# Altium schematic sheet Schematic.SchDoc
size A4; SheetNumber: 1; SheetTotal: 1
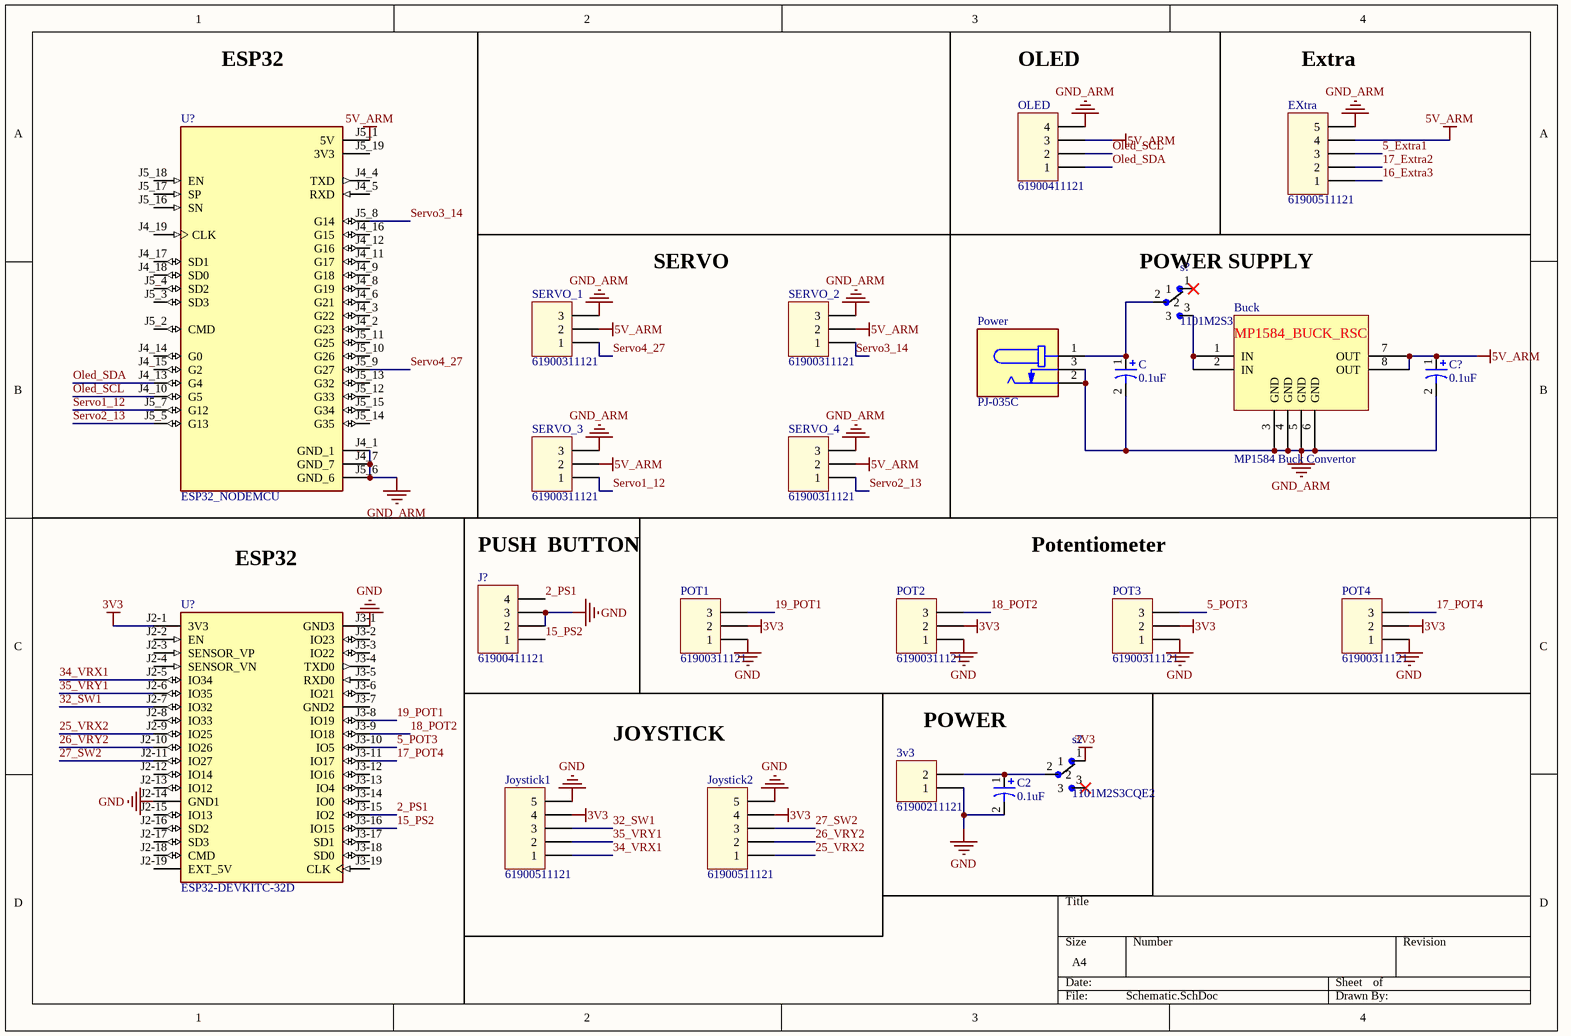
[diagram p0: Schematic.SchDoc]

## Parts
(Parts that share a designator on the sheet are numbered #1, #2 ... from top to bottom, then left to right.)
3v3  61900211121  [61900211121]
Buck  MP1584 Buck Convertor  [MP1584]
C  0.1uF  [WCAP-AT1H 5x11x2x0.5]
C2  0.1uF  [WCAP-AT1H 5x11x2x0.5]
C?  0.1uF  [WCAP-AT1H 5x11x2x0.5]
EXtra  61900511121  [61900511121]
J?  61900411121  [61900411121]
Joystick1  61900511121  [61900511121]
Joystick2  61900511121  [61900511121]
OLED  61900411121  [61900411121]
POT1  61900311121  [61900311121]
POT2  61900311121  [61900311121]
POT3  61900311121  [61900311121]
POT4  61900311121  [61900311121]
Power  PJ-035C  [CUI_PJ-035C]
s2  1101M2S3CQE2  [SW_1101M2S3CQE2]
s?  1101M2S3CQE2  [SW_1101M2S3CQE2]
SERVO_1  61900311121  [61900311121]
SERVO_2  61900311121  [61900311121]
SERVO_3  61900311121  [61900311121]
SERVO_4  61900311121  [61900311121]
U?#1  ESP32_NODEMCU  [MODULE_ESP32_NODEMCU]
U?#2  ESP32-DEVKITC-32D  [MODULE_ESP32-DEVKITC-32D]

## Nets
3V3: Joystick1.4 Joystick2.4 POT1.2 POT2.2 POT3.2 POT4.2 s2.1 U?#2.J2-1(3V3)
5V_ARM: Buck.7(OUT) Buck.8(OUT) C?.1 EXtra.4 OLED.3 SERVO_1.2 SERVO_2.2 SERVO_3.2 SERVO_4.2 U?#1.J5_1(5V)
GND: 3v3.1 C2.2 J?.2 J?.3 Joystick1.5 Joystick2.5 POT1.1 POT2.1 POT3.1 POT4.1 U?#2.J2-14(GND1) U?#2.J3-1(GND3)
GND_ARM: Buck.3(GND) Buck.4(GND) Buck.5(GND) Buck.6(GND) C.2 C?.2 EXtra.5 OLED.4 Power.2 Power.3 SERVO_1.3 SERVO_2.3 SERVO_3.3 SERVO_4.3 U?#1.J4_1(GND_1) U?#1.J4_7(GND_7) U?#1.J5_6(GND_6)
2_PS1: J?.4 U?#2.J3-15(IO2)
5_Extra1: EXtra.3
5_POT3: POT3.3 U?#2.J3-10(IO5)
15_PS2: J?.1 U?#2.J3-16(IO15)
16_Extra3: EXtra.1
17_Extra2: EXtra.2
17_POT4: POT4.3 U?#2.J3-11(IO17)
18_POT2: POT2.3 U?#2.J3-9(IO18)
19_POT1: POT1.3 U?#2.J3-8(IO19)
25_VRX2: Joystick2.1 U?#2.J2-9(IO25)
26_VRY2: Joystick2.2 U?#2.J2-10(IO26)
27_SW2: Joystick2.3 U?#2.J2-11(IO27)
32_SW1: Joystick1.3 U?#2.J2-7(IO32)
34_VRX1: Joystick1.1 U?#2.J2-5(IO34)
35_VRY1: Joystick1.2 U?#2.J2-6(IO35)
Oled_SCL: OLED.2 U?#1.J4_10(G5)
Oled_SDA: OLED.1 U?#1.J4_13(G4)
Servo1_12: SERVO_3.1 U?#1.J5_7(G12)
Servo2_13: SERVO_4.1 U?#1.J5_5(G13)
Servo3_14: SERVO_2.1 U?#1.J5_8(G14)
Servo4_27: SERVO_1.1 U?#1.J5_9(G27)
Net3v3_2: 3v3.2 C2.1 s2.2
NetBuck_1: Buck.1(IN) Buck.2(IN) s?.3
NetC_1: C.1 Power.1 s?.2

Not connected (* = marked no-connect by the designer): s2 3*; s? 1*; U?#1 J4_2(G23) J4_3(G22) J4_4(TXD) J4_5(RXD) J4_6(G21) J4_8(G19) J4_9(G18) J4_11(G17) J4_12(G16) J4_14(G0) J4_15(G2) J4_16(G15) J4_17(SD1) J4_18(SD0) J4_19(CLK) J5_2(CMD) J5_3(SD3) J5_4(SD2) J5_10(G26) J5_11(G25) J5_12(G33) J5_13(G32) J5_14(G35) J5_15(G34) J5_16(SN) J5_17(SP) J5_18(EN) J5_19(3V3); U?#2 J2-2(EN) J2-3(SENSOR_VP) J2-4(SENSOR_VN) J2-8(IO33) J2-12(IO14) J2-13(IO12) J2-15(IO13) J2-16(SD2) J2-17(SD3) J2-18(CMD) J2-19(EXT_5V) J3-2(IO23) J3-3(IO22) J3-4(TXD0) J3-5(RXD0) J3-6(IO21) J3-7(GND2) J3-12(IO16) J3-13(IO4) J3-14(IO0) J3-17(SD1) J3-18(SD0) J3-19(CLK)

## Notes on the sheet
- ESP32
- OLED
- Extra
- SERVO
- (near s?) POWER SUPPLY
- PUSH  BUTTON
- Potentiometer
- JOYSTICK
- POWER
- (in symbol MP1584 Buck Convertor) MP1584_BUCK_RSC

## Library data of the parts
3v3 = 61900211121: WR-WTB 2.54mm Male Locking Header, 2p; Pin Number: 2; ComponentLink1Description: Manufacturer; ComponentLink1URL: http://www.we-online.de; ComponentLink2Description: Datasheet; ComponentLink2URL: http://katalog.we-online.de/em/datasheet/6190xx11121.pdf; Part Number: 61900211121; Published Date: June 2017; Publisher: Wurth Elektronik; Pitch: 2.54 mm
C C2 C? = WCAP-AT1H 5x11x2x0.5 860240372001: WCAP-AT1H Aluminum Electrolytic Capacitors , 33 μF; + / - 20%; 16 V , 5 x 11; Manufacturer: Wurth Elektronik; E-mail: libraries@we-online.com; Capacitance: 33 μF; Characteristics: Aluminum Electrolytic Capacitor; Recommended soldering: Wave; Operating temperature:–40 °C to +105 °C for UR < 400 V; –25 °C to +105 °C for UR ≥ 400 V; Long life product series; Higher permissible ripple current; Load life: 5000–10000 h @ +105 °C; ComponentLink1Description: Manufacturer; ComponentLink1URL: http://www.we-online.com; ComponentLink2Description: Datasheet; ComponentLink2URL: http://katalog.we-online.de/pbs/datasheet/860240372001.pdf; Created by: Karrer Zheng; Created Date: 6/8/2015; Application: Medium and high voltage type range from 160V-450V used as primary side input filter in power supply; Low voltage type used as energy storage or low frequency filtering in circuit, applied to general switching power supply, AC-DC converter, adapter, charger, TV, VCR, DC motor circuit filter, digital audio, digital cameras, digital video cameras, satellite receiver etc.; partNo: 860240372001
EXtra Joystick1 Joystick2 = 61900511121: WR-WTB 2.54mm Male Locking Header, 5p; Pin Number: 5; ComponentLink1Description: Manufacturer; ComponentLink1URL: http://www.we-online.de; ComponentLink2Description: Datasheet; ComponentLink2URL: http://katalog.we-online.de/em/datasheet/6190xx11121.pdf; Part Number: 61900511121; Published Date: June 2017; Publisher: Wurth Elektronik; Pitch: 2.54 mm
J? OLED = 61900411121: WR-WTB 2.54mm Male Locking Header, 4p; Pin Number: 4; ComponentLink1Description: Manufacturer; ComponentLink1URL: http://www.we-online.de; ComponentLink2Description: Datasheet; ComponentLink2URL: http://katalog.we-online.de/em/datasheet/6190xx11121.pdf; Part Number: 61900411121; Published Date: June 2017; Publisher: Wurth Elektronik; Pitch: 2.54 mm
POT1-POT4 SERVO_1-SERVO_4 = 61900311121: WR-WTB 2.54mm Male Locking Header, 3p; Pin Number: 3; ComponentLink1Description: Manufacturer; ComponentLink1URL: http://www.we-online.de; ComponentLink2Description: Datasheet; ComponentLink2URL: http://katalog.we-online.de/em/datasheet/6190xx11121.pdf; Part Number: 61900311121; Published Date: June 2017; Publisher: Wurth Elektronik; Pitch: 2.54 mm
Power = PJ-035C: 1.0 x 3.8 mm, 2.0 A, Horizontal, Through Hole, Dc Power Jack Connector; MF: Same Sky; SnapEDA_Link: https://www.snapeda.com/parts/PJ-035C/Same+Sky/view-part/?ref=snap; Package: None; Value: *; MP: PJ-035C; Check_prices: https://www.snapeda.com/parts/PJ-035C/Same+Sky/view-part/?ref=eda
s2 s? = 1101M2S3CQE2: Switch, Slide, PC Terminal, SPST, ON-NONE-OFF, 0.4VA MAX@120VAC OR VDC MAX; MF: C&K Components; MP: 1101M2S3CQE2; Package: None; Price: 2.65 USD; Availability: Good; SnapEDA_Link: https://www.snapeda.com/symbols-footprints/1101M2S3CQE2/C%26K%20Components/view-part/?ref=snap; Value: *
U?#1 = ESP32_NODEMCU: NodeMCU is an open source loT platform. ESP32 is a series of low cost, low powersystem-on-chip (SoC) microcontrollers with integrated Wi-Fi and dual-mode Bluetooth.; MF: AZ Delivery; MP: ESP32 NODEMCU; SnapEDA_Link: https://www.snapeda.com/parts/ESP32%20NODEMCU/AZ+Displays/view-part/?ref=snap; Package: Package; Value: *; Check_prices: https://www.snapeda.com/parts/ESP32%20NODEMCU/AZ+Displays/view-part/?ref=eda
U?#2 = ESP32-DEVKITC-32D: WiFi Development Tools (802.11) ESP32 General Development Kit, ESP32-WROOM-32D on the board; MF: Espressif Systems; SnapEDA_Link: https://www.snapeda.com/parts/ESP32-DEVKITC-32D/Espressif+Systems/view-part/?ref=snap; Package: None; Value: *; MP: ESP32-DEVKITC-32D; Check_prices: https://www.snapeda.com/parts/ESP32-DEVKITC-32D/Espressif+Systems/view-part/?ref=eda